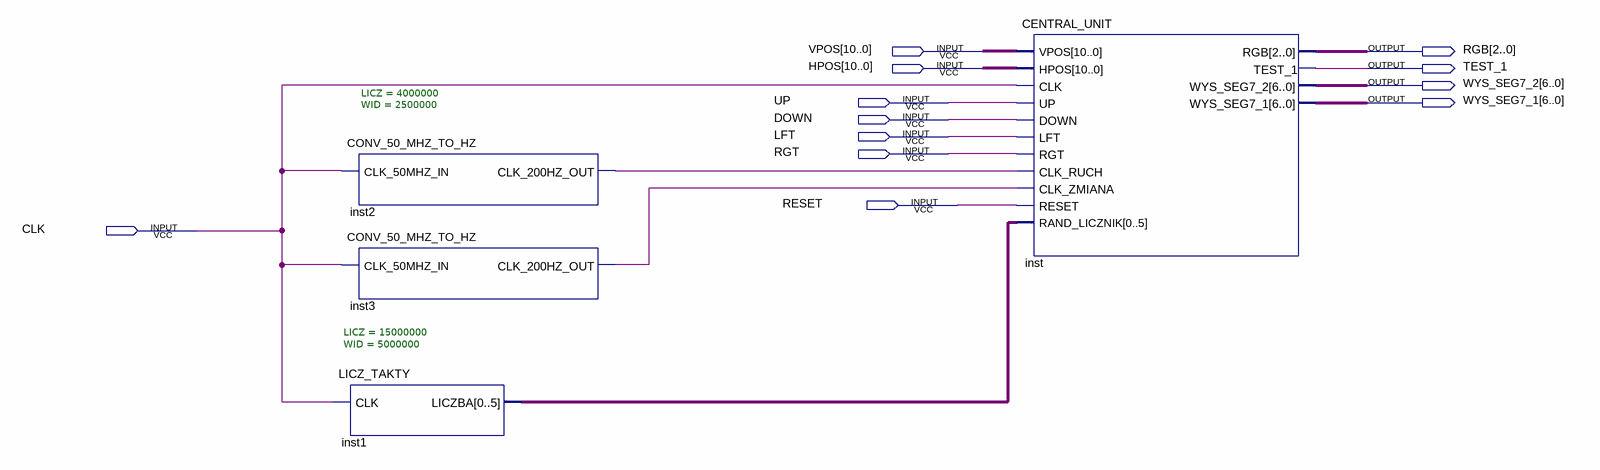
[diagram p0: schematic sheet]
// Quartus schematic central_u.bdf as structural Verilog: 4 symbols, 12 pins
module central_u (
  input  [10:0] VPOS,
  input  [10:0] HPOS,
  input  UP,
  input  DOWN,
  input  LFT,
  input  RGT,
  input  RESET,
  input  CLK,
  output [2:0] RGB,
  output TEST_1,
  output [6:0] WYS_SEG7_2,
  output [6:0] WYS_SEG7_1
);

  wire inst2_clk_200hz_out, inst3_clk_200hz_out;
  wire [5:0] inst1_liczba;

  CONV_50_MHZ_TO_HZ #(.LICZ(4000000), .WID(2500000)) inst2 (.CLK_50MHZ_IN(CLK), .CLK_200HZ_OUT(inst2_clk_200hz_out));
  CONV_50_MHZ_TO_HZ #(.LICZ(15000000), .WID(5000000)) inst3 (.CLK_50MHZ_IN(CLK), .CLK_200HZ_OUT(inst3_clk_200hz_out));
  LICZ_TAKTY inst1 (.CLK(CLK), .LICZBA(inst1_liczba));
  CENTRAL_UNIT inst (
    .VPOS(VPOS), .HPOS(HPOS), .CLK(CLK), .UP(UP), .DOWN(DOWN), .LFT(LFT), .RGT(RGT),
    .CLK_RUCH(inst2_clk_200hz_out), .CLK_ZMIANA(inst3_clk_200hz_out), .RESET(RESET),
    .RAND_LICZNIK(inst1_liczba), .RGB(RGB), .TEST_1(TEST_1), .WYS_SEG7_2(WYS_SEG7_2), .WYS_SEG7_1(WYS_SEG7_1));
endmodule
